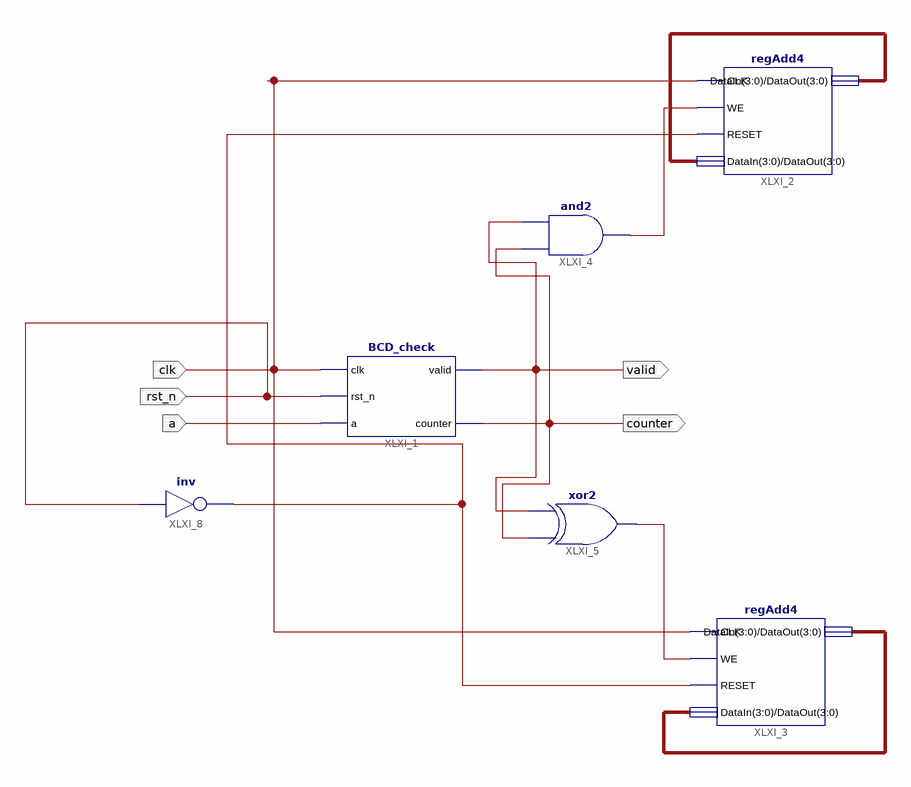
[diagram p0: schematic sheet 1]
// Xilinx ISE schematic BCD_check_register.sch (spartan3e) as structural Verilog: 6 symbols, 5 ports
module BCD_check_register (
  input  clk,
  input  a,
  input  rst_n,
  output valid,
  output counter
);

  wire XLXN_10, XLXN_11, XLXN_30;
  wire [3:0] InvalidCounter, ValidCounter;

  BCD_check XLXI_1 (.clk(clk), .rst_n(rst_n), .a(a), .valid(valid), .counter(counter));
  regAdd4 XLXI_2 (.CLK(clk), .WE(XLXN_10), .RESET(XLXN_30), .DataIn(ValidCounter), .DataOut(ValidCounter));
  regAdd4 XLXI_3 (.CLK(clk), .WE(XLXN_11), .RESET(XLXN_30), .DataIn(InvalidCounter), .DataOut(InvalidCounter));
  and XLXI_4 (XLXN_10, counter, valid);
  xor XLXI_5 (XLXN_11, counter, valid);
  not XLXI_8 (XLXN_30, rst_n);
endmodule
